# EAGLE design FMtransmitter (EAGLE 6.5.0)
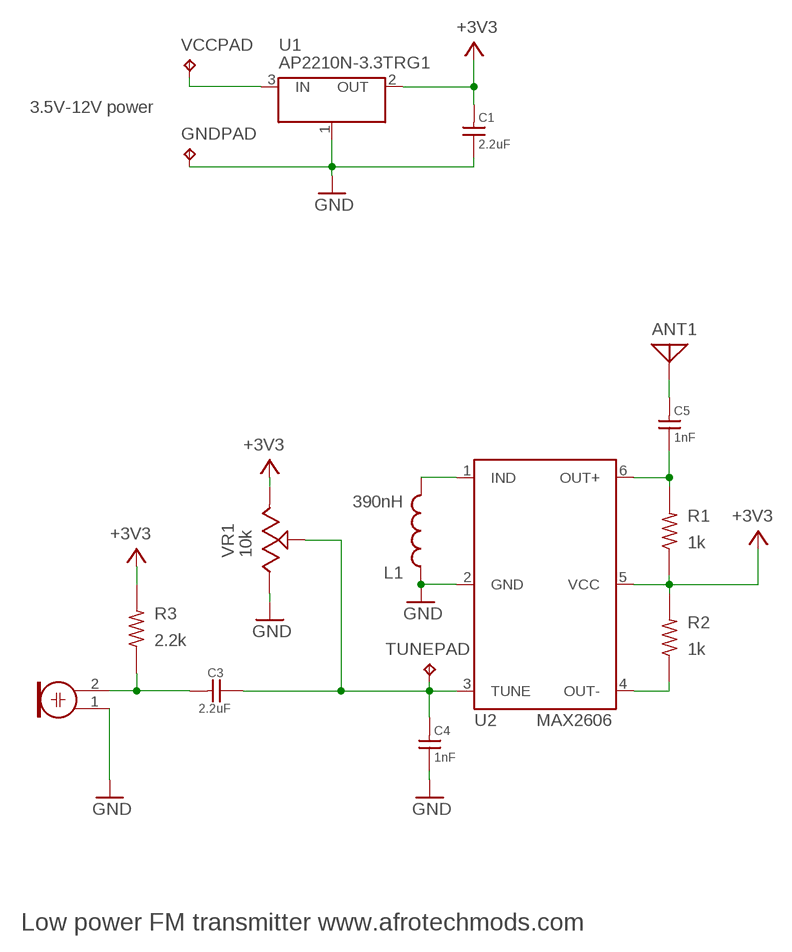
[diagram p0: schematic, sheet 1]

## Parts
ANT1  ANTENNA  [PAD-01]
C1  2.2uF  CAPACITOR-0805  [0805]
C3  2.2uF  CAPACITOR-0805  [0805]
C4  1nF  CAPACITOR-0805  [0805]
C5  1nF  CAPACITOR-0805  [0805]
GNDPAD  TPPAD1-13  [P1-13]
L1  390nH  INDUCTOR-0805  [0805]
MK1  ELECTRET_MICROPHON-WM-64PC/64PK  [WM-64PC/64PK]
R1  1k  RESISTOR-0805  [0805]
R2  1k  RESISTOR-0805  [0805]
R3  2.2k  RESISTOR-0805  [0805]
TUNEPAD  TPPAD1-13  [P1-13]
U1  AP2210N-3.3TRG1  [SOT-23]
U2  MAX2606  [SOT23-6]
VCCPAD  TPPAD1-13  [P1-13]
VR1  10k  TRIMPOT  [SMDPOT]

## Nets
+3V3: C1.P$2 R1.P$2 R2.P$1 R3.P$1 U1.2(OUT) U2.5(VCC) VR1.3(E)
GND: C1.P$1 C4.P$1 GNDPAD.TP L1.P$1 MK1.1 U1.1(GND) U2.2(GND) VR1.1(A)
N$1: L1.P$2 U2.1(IND)
N$3: U1.3(IN) VCCPAD.TP
N$4: C5.P$1 R1.P$1 U2.6(OUT+)
N$5: R2.P$2 U2.4(OUT-)
N$6: ANT1.1 C5.P$2
N$7: C3.P$2 MK1.2 R3.P$2
TUNE: C3.P$1 C4.P$2 TUNEPAD.TP U2.3(TUNE) VR1.2(WIPER)

## Notes on the sheet
- 3.5V-12V power
- Low power FM transmitter www.afrotechmods.com

## Library data of the parts
ANT1 = discrete:ANTENNA: Antenna
C1 C3-C5 = FM Transmitter:CAPACITOR-0805
GNDPAD TUNEPAD VCCPAD = testpad:TP: Test pad
L1 = FM Transmitter:INDUCTOR-0805
MK1 = microphon:ELECTRET_MICROPHON-: Electret Condenser Microphone
R1-R3 = FM Transmitter:RESISTOR-0805
U1 = FM Transmitter:AP2210N-3.3TRG1
U2 = FM Transmitter:MAX2606
VR1 = FM Transmitter:TRIMPOT

## Board
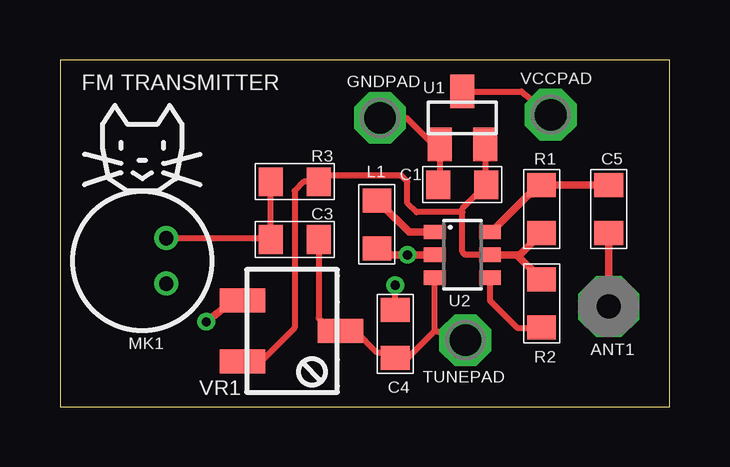
[diagram p1: board, top side]
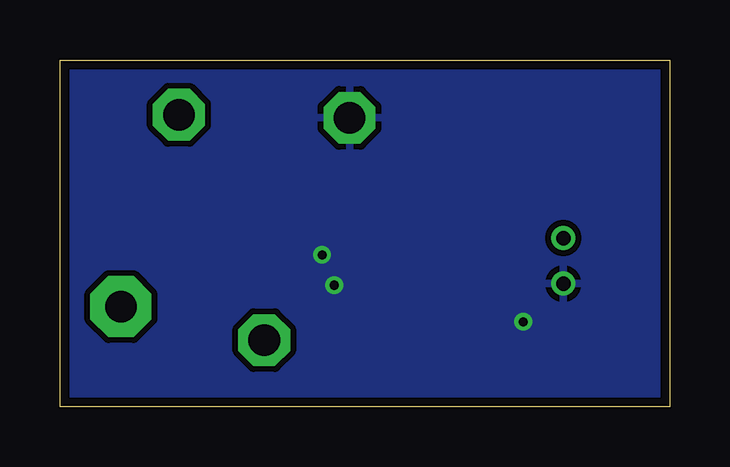
[diagram p2: board, bottom side, seen from below]

Size 25.4 x 14.48 mm. Coordinates in mm from the lower left corner, seen from the top.
Outline: 0,0 25.4,0 25.4,14.48 0,14.48 0,0
Copper layers (1*16): Top 0.0356mm / dielectric 1.5011mm / Bottom 0.0356mm
Design rules "LaenPCBOrder": minimum track width 6mil, minimum drill 13mil, track to track 6mil, track to pad 6mil, pad to pad 6mil, via to via 6mil, smd to smd 6mil, copper to edge 15mil, drill to drill 6mil, minimum pad ring 7mil, minimum via ring 7mil, stop-mask expansion 3mil, vias tented up to drill 0mil, thermal gap 10mil

### Footprints (pad centres in the part's own frame; a part is rotated, then mirrored left to right if it is on the bottom)
PAD-01 = drill 1.321 pad 2.54 octagon: 1 0,0
0805 = smd 1 x 1.2: P$1 -1,0; P$2 1,0
P1-13 = drill 1.321 pad 2.159 octagon: TP 0,0
WM-64PC/64PK = drill 0.6 pad 1: 1 -1,0.95; 2 -1,-0.95
SOT-23 = smd 1.4 x 1: 1 -1.1,0.95; 2 -1.1,-0.95; 3 1.1,0
SOT23-6 = smd 0.9 x 0.6: 1 -1.15,0.95; 2 -1.15,0; 3 -1.15,-0.95; 4 1.15,-0.95; 5 1.15,0; 6 1.15,0.95
SMDPOT = smd 1.9 x 1.016: 1 -2.042,1.27; 2 2.042,0; 3 -2.042,-1.27

### Placement (x,y rotation side)
ANT1  22.86,4.19 0 top
C1  16.76,9.27 0 top
C3  9.78,6.99 180 top
C4  13.97,3.05 270 top
C5  22.86,8.26 270 top
GNDPAD  13.34,12.06 0 top
L1  13.21,7.62 90 top
MK1  3.43,6.1 180 top
R1  20.07,8.26 270 top
R2  20.07,4.32 270 top
R3  9.78,9.4 180 top
TUNEPAD  16.89,2.79 180 top
U1  16.76,12.06 90 top
U2  16.76,6.35 0 top
VCCPAD  20.45,12.19 0 top
VR1  9.65,3.17 0 top

### Tracks (layer width: path | path; a pad name or v marks a point on that pad's centre or on a via)
+3V3
  Top 0.254: 17.7,9.33 C1.P$2 | U2.5 16.89,6.35 16.76,6.48 16.76,8.13 | 16.76,8.13 16.76,8.27 C1.P$2 | VR1.3 8.38,1.91 9.78,3.3 9.78,9.02 10.16,9.4 R3.P$1 11.03,9.65 14.22,9.65 14.48,9.4 14.48,8.51 14.86,8.13 16.76,8.13 | U1.2 17.71,9.32 C1.P$2
  Top 0.305: U2.5 19.03,6.35 | 19.03,6.35 R2.P$1 | 19.03,6.35 19.16,6.35 R1.P$2
GND  (via drill 0.38)
  Top 0.254: 15.77,9.28 C1.P$1 15.81,9.32 15.81,10.67 | U1.1 15.81,10.67 | C4.P$1 v13.97,5.08 | GNDPAD.TP 14.42,12.06 15.81,10.67
  Top 0.305: U2.2 v14.48,6.35 13.48,6.35 L1.P$1 | VR1.1 7.24,4.45 v6.1,3.56
  pour Bottom (isolate 0.254): 0.25,14.22 24.89,14.22 24.89,0.25 0.25,0.25
N$1
  Top 0.305: U2.1 14.54,7.3 13.97,7.87 13.95,7.87 L1.P$2
N$3
  Top 0.254: U1.3 19.22,13.16 VCCPAD.TP
N$4
  Top 0.305: 18.11,7.3 18.11,7.44 19.56,8.89 19.7,8.89 R1.P$1 C5.P$1
  Top 0.406: U2.6 18.11,7.3
N$5
  Top 0.254: U2.4 17.91,4.44 19.05,3.3 20.05,3.3 R2.P$2
N$6
  Top 0.305: C5.P$2 ANT1.1
N$7
  Top 0.254: MK1.2 8.72,7.05 C3.P$2 R3.P$2
TUNE
  Top 0.254: TUNEPAD.TP 16.76,2.79 15.62,3.17 | 15.62,3.17 15.62,5.39 U2.3 | 11.57,3.05 VR1.2 | 15.62,3.17 14.49,2.05 C4.P$2 13.73,2.29 13.21,2.29 12.32,3.17 VR1.2 | C3.P$1 10.78,3.7 11.18,3.3 11.57,3.3 VR1.2

### Text on the board
tPlace: FM TRANSMITTER